# Altium schematic sheet General.SchDoc: GENERAL
size A4; Author: MOG; CompanyName: GIE GROUP; DrawnBy: MOG; Organization: Gie SA; Address1: Galicia 52; Address2: Mar del Plata; Address3: Buenos Aires; Address4: Argentina; DocumentNumber: 1; Revision: 0.0; SheetNumber: 1; SheetTotal: 14; Project: CP DATALOGGER; PageSetup: Record=PageOptions|CenterHorizontal=True|CenterVertical=True|PrintScale=0.94|XCorrection=1.00|YCorrection=1.00|PrintKind=0|BorderSize=5000000|LeftOffset=0|BottomOffset=0|Orientation=2|PaperLength=1000|PaperWidth=1000|Scale=100|PaperSource=7|PrintQuality=720|MediaType=1|DitherType=10|PaperKind=A4|PrintScaleMode=1
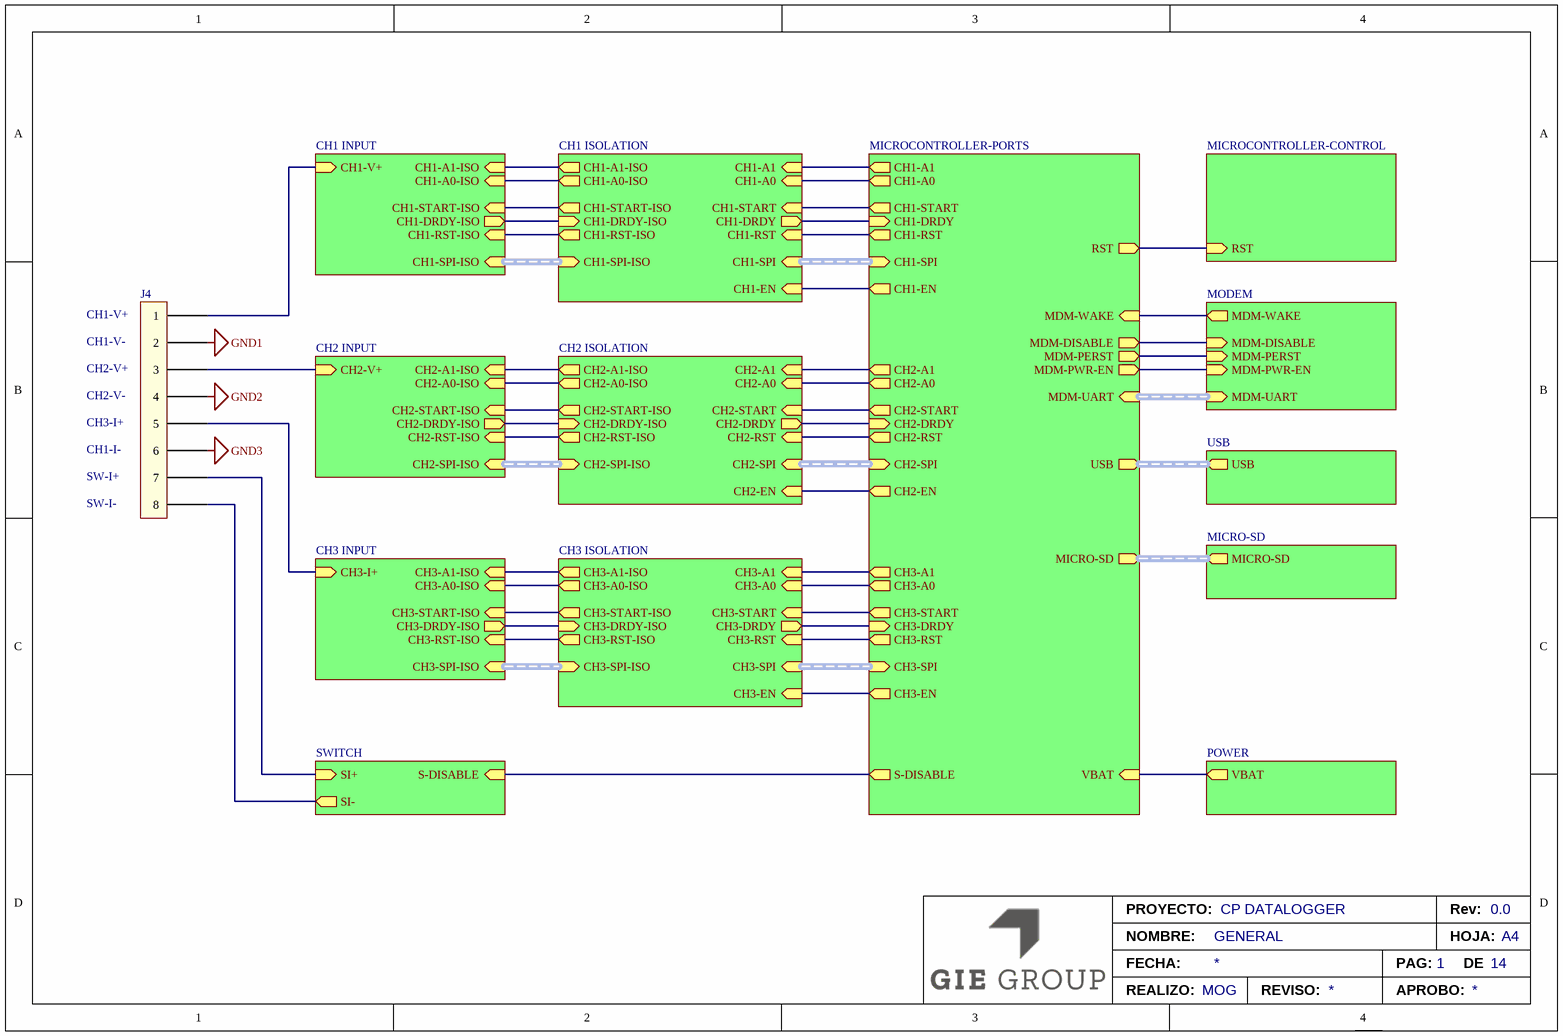
[diagram p0: General.SchDoc]

## Parts
J4  (no value)  [TE-640455-8]

## Sub-sheets
CH1 INPUT = CH1-Input.SchDoc: CH1-A0-ISO (in), CH1-A1-ISO (in), CH1-START-ISO (in), CH1-DRDY-ISO (out), CH1-RST-ISO (in), CH1-SPI-ISO (in, harness CH1-SPI-ISO), CH1-V+ (in)
CH1 ISOLATION = CH1-Isolation.SchDoc: CH1-A0-ISO (out), CH1-A1-ISO (out), CH1-START-ISO (out), CH1-DRDY-ISO (in), CH1-RST-ISO (out), CH1-SPI-ISO (in, harness CH1-SPI-ISO), CH1-A0 (in), CH1-A1 (in), CH1-START (in), CH1-DRDY (out), CH1-RST (in), CH1-SPI (in, harness CH1-SPI), CH1-EN (in)
CH2 INPUT = CH2-Input.SchDoc: CH2-A0-ISO (in), CH2-A1-ISO (in), CH2-START-ISO (in), CH2-DRDY-ISO (out), CH2-RST-ISO (in), CH2-SPI-ISO (in, harness CH2-SPI-ISO), CH2-V+ (in)
CH2 ISOLATION = CH2-Isolation.SchDoc: CH2-A0-ISO (out), CH2-A1-ISO (out), CH2-START-ISO (out), CH2-DRDY-ISO (in), CH2-RST-ISO (out), CH2-SPI-ISO (in, harness CH2-SPI-ISO), CH2-A0 (in), CH2-A1 (in), CH2-START (in), CH2-DRDY (out), CH2-RST (in), CH2-SPI (in, harness CH2-SPI), CH2-EN (in)
CH3 INPUT = CH3-Input.SchDoc: CH3-A0-ISO (in), CH3-A1-ISO (in), CH3-START-ISO (in), CH3-DRDY-ISO (out), CH3-RST-ISO (in), CH3-SPI-ISO (in, harness CH3-SPI-ISO), CH3-I+ (in)
CH3 ISOLATION = CH3-Isolation.SchDoc: CH3-A0-ISO (out), CH3-A1-ISO (out), CH3-START-ISO (out), CH3-DRDY-ISO (in), CH3-RST-ISO (out), CH3-SPI-ISO (in, harness CH3-SPI-ISO), CH3-A0 (in), CH3-A1 (in), CH3-START (in), CH3-DRDY (out), CH3-RST (in), CH3-SPI (in, harness CH3-SPI), CH3-EN (in)
MICRO-SD = MicroSD.SchDoc: MICRO-SD (out, harness MICRO-SD)
MICROCONTROLLER-CONTROL = MicrocontrollerControl.SchDoc: RST (in)
MICROCONTROLLER-PORTS = MicrocontrollerPorts.SchDoc: CH1-A0 (out), CH1-A1 (out), CH1-START (out), CH1-DRDY (in), CH1-RST (out), CH1-SPI (in, harness CH1-SPI), CH1-EN (out), CH2-A0 (out), CH2-A1 (out), CH2-START (out), CH2-DRDY (in), CH2-RST (out), CH2-SPI (in, harness CH2-SPI), CH2-EN (out), CH3-A0 (out), CH3-A1 (out), CH3-START (out), CH3-DRDY (in), CH3-RST (out), CH3-SPI (in, harness CH3-SPI), CH3-EN (out), S-DISABLE (out), MDM-UART (in, harness MDM-UART), MDM-WAKE (in), MDM-DISABLE (out), MDM-PERST (out), MDM-PWR-EN (out), VBAT (in), RST (out), USB (out, harness USB), MICRO-SD (out, harness MICRO-SD)
MODEM = Modem.SchDoc: MDM-UART (in, harness MDM-UART), MDM-WAKE (out), MDM-DISABLE (in), MDM-PERST (in), MDM-PWR-EN (in)
POWER = Power.SchDoc: VBAT (out)
SWITCH = Switch.SchDoc: S-DISABLE (in), SI+ (in), SI- (out)
USB = Usb.SchDoc: USB (out, harness USB)

## Nets
GND1: J4.2
GND2: J4.4
GND3: J4.6
NetJ4_1: J4.1 ; sheet CH1 INPUT/CH1-V+
NetJ4_3: J4.3 ; sheet CH2 INPUT/CH2-V+
NetJ4_5: J4.5 ; sheet CH3 INPUT/CH3-I+
NetJ4_7: J4.7 ; sheet SWITCH/SI+
NetJ4_8: J4.8 ; sheet SWITCH/SI-
(unnamed): sheet CH1 INPUT/CH1-A0-ISO, sheet CH1 ISOLATION/CH1-A0-ISO
(unnamed): sheet CH1 INPUT/CH1-A1-ISO, sheet CH1 ISOLATION/CH1-A1-ISO
(unnamed): sheet CH1 INPUT/CH1-START-ISO, sheet CH1 ISOLATION/CH1-START-ISO
(unnamed): sheet CH1 INPUT/CH1-DRDY-ISO, sheet CH1 ISOLATION/CH1-DRDY-ISO
(unnamed): sheet CH1 INPUT/CH1-RST-ISO, sheet CH1 ISOLATION/CH1-RST-ISO
(unnamed): sheet CH1 ISOLATION/CH1-A0, sheet MICROCONTROLLER-PORTS/CH1-A0
(unnamed): sheet CH1 ISOLATION/CH1-A1, sheet MICROCONTROLLER-PORTS/CH1-A1
(unnamed): sheet CH1 ISOLATION/CH1-START, sheet MICROCONTROLLER-PORTS/CH1-START
(unnamed): sheet CH1 ISOLATION/CH1-DRDY, sheet MICROCONTROLLER-PORTS/CH1-DRDY
(unnamed): sheet CH1 ISOLATION/CH1-RST, sheet MICROCONTROLLER-PORTS/CH1-RST
(unnamed): sheet CH1 ISOLATION/CH1-EN, sheet MICROCONTROLLER-PORTS/CH1-EN
(unnamed): sheet CH2 INPUT/CH2-A0-ISO, sheet CH2 ISOLATION/CH2-A0-ISO
(unnamed): sheet CH2 INPUT/CH2-A1-ISO, sheet CH2 ISOLATION/CH2-A1-ISO
(unnamed): sheet CH2 INPUT/CH2-START-ISO, sheet CH2 ISOLATION/CH2-START-ISO
(unnamed): sheet CH2 INPUT/CH2-DRDY-ISO, sheet CH2 ISOLATION/CH2-DRDY-ISO
(unnamed): sheet CH2 INPUT/CH2-RST-ISO, sheet CH2 ISOLATION/CH2-RST-ISO
(unnamed): sheet CH2 ISOLATION/CH2-A0, sheet MICROCONTROLLER-PORTS/CH2-A0
(unnamed): sheet CH2 ISOLATION/CH2-A1, sheet MICROCONTROLLER-PORTS/CH2-A1
(unnamed): sheet CH2 ISOLATION/CH2-START, sheet MICROCONTROLLER-PORTS/CH2-START
(unnamed): sheet CH2 ISOLATION/CH2-DRDY, sheet MICROCONTROLLER-PORTS/CH2-DRDY
(unnamed): sheet CH2 ISOLATION/CH2-RST, sheet MICROCONTROLLER-PORTS/CH2-RST
(unnamed): sheet CH2 ISOLATION/CH2-EN, sheet MICROCONTROLLER-PORTS/CH2-EN
(unnamed): sheet MODEM/MDM-WAKE, sheet MICROCONTROLLER-PORTS/MDM-WAKE
(unnamed): sheet MODEM/MDM-DISABLE, sheet MICROCONTROLLER-PORTS/MDM-DISABLE
(unnamed): sheet MODEM/MDM-PERST, sheet MICROCONTROLLER-PORTS/MDM-PERST
(unnamed): sheet MODEM/MDM-PWR-EN, sheet MICROCONTROLLER-PORTS/MDM-PWR-EN
(unnamed): sheet CH3 INPUT/CH3-A0-ISO, sheet CH3 ISOLATION/CH3-A0-ISO
(unnamed): sheet CH3 INPUT/CH3-A1-ISO, sheet CH3 ISOLATION/CH3-A1-ISO
(unnamed): sheet CH3 INPUT/CH3-START-ISO, sheet CH3 ISOLATION/CH3-START-ISO
(unnamed): sheet CH3 INPUT/CH3-DRDY-ISO, sheet CH3 ISOLATION/CH3-DRDY-ISO
(unnamed): sheet CH3 INPUT/CH3-RST-ISO, sheet CH3 ISOLATION/CH3-RST-ISO
(unnamed): sheet CH3 ISOLATION/CH3-A0, sheet MICROCONTROLLER-PORTS/CH3-A0
(unnamed): sheet CH3 ISOLATION/CH3-A1, sheet MICROCONTROLLER-PORTS/CH3-A1
(unnamed): sheet CH3 ISOLATION/CH3-START, sheet MICROCONTROLLER-PORTS/CH3-START
(unnamed): sheet CH3 ISOLATION/CH3-DRDY, sheet MICROCONTROLLER-PORTS/CH3-DRDY
(unnamed): sheet CH3 ISOLATION/CH3-RST, sheet MICROCONTROLLER-PORTS/CH3-RST
(unnamed): sheet CH3 ISOLATION/CH3-EN, sheet MICROCONTROLLER-PORTS/CH3-EN
(unnamed): sheet SWITCH/S-DISABLE, sheet MICROCONTROLLER-PORTS/S-DISABLE
(unnamed): sheet MICROCONTROLLER-PORTS/VBAT, sheet POWER/VBAT
(unnamed): sheet MICROCONTROLLER-PORTS/RST, sheet MICROCONTROLLER-CONTROL/RST

## Buses and harness runs
harness sheet CH1 INPUT/CH1-SPI-ISO = sheet CH1 ISOLATION/CH1-SPI-ISO
harness sheet CH1 ISOLATION/CH1-SPI = sheet MICROCONTROLLER-PORTS/CH1-SPI
harness sheet CH2 INPUT/CH2-SPI-ISO = sheet CH2 ISOLATION/CH2-SPI-ISO
harness sheet CH2 ISOLATION/CH2-SPI = sheet MICROCONTROLLER-PORTS/CH2-SPI
harness sheet CH3 INPUT/CH3-SPI-ISO = sheet CH3 ISOLATION/CH3-SPI-ISO
harness sheet CH3 ISOLATION/CH3-SPI = sheet MICROCONTROLLER-PORTS/CH3-SPI
harness sheet MICRO-SD/MICRO-SD = sheet MICROCONTROLLER-PORTS/MICRO-SD
harness sheet MICROCONTROLLER-PORTS/MDM-UART = sheet MODEM/MDM-UART
harness sheet MICROCONTROLLER-PORTS/USB = sheet USB/USB

## Notes on the sheet
- (near J4) CH1-V+
- (near J4) CH1-V-
- (near J4) CH2-V+
- (near J4) CH2-V-
- (near J4) CH3-I+
- (near J4) CH1-I-
- (near J4) SW-I+
- (near J4) SW-I-
- PROYECTO:
- Rev:
- NOMBRE:
- FECHA:
- REALIZO:
- REVISO:
- APROBO:
- PAG:
- HOJA:
- DE
- A4

## Library data of the parts
J4 = 640455-8: CONN HEADER RTANG 8POS .100 TIN; Mating Conn: 1375820-8